# EAGLE design fresh_air_control (EAGLE 9.6.2)

## Sheet 1 of 2
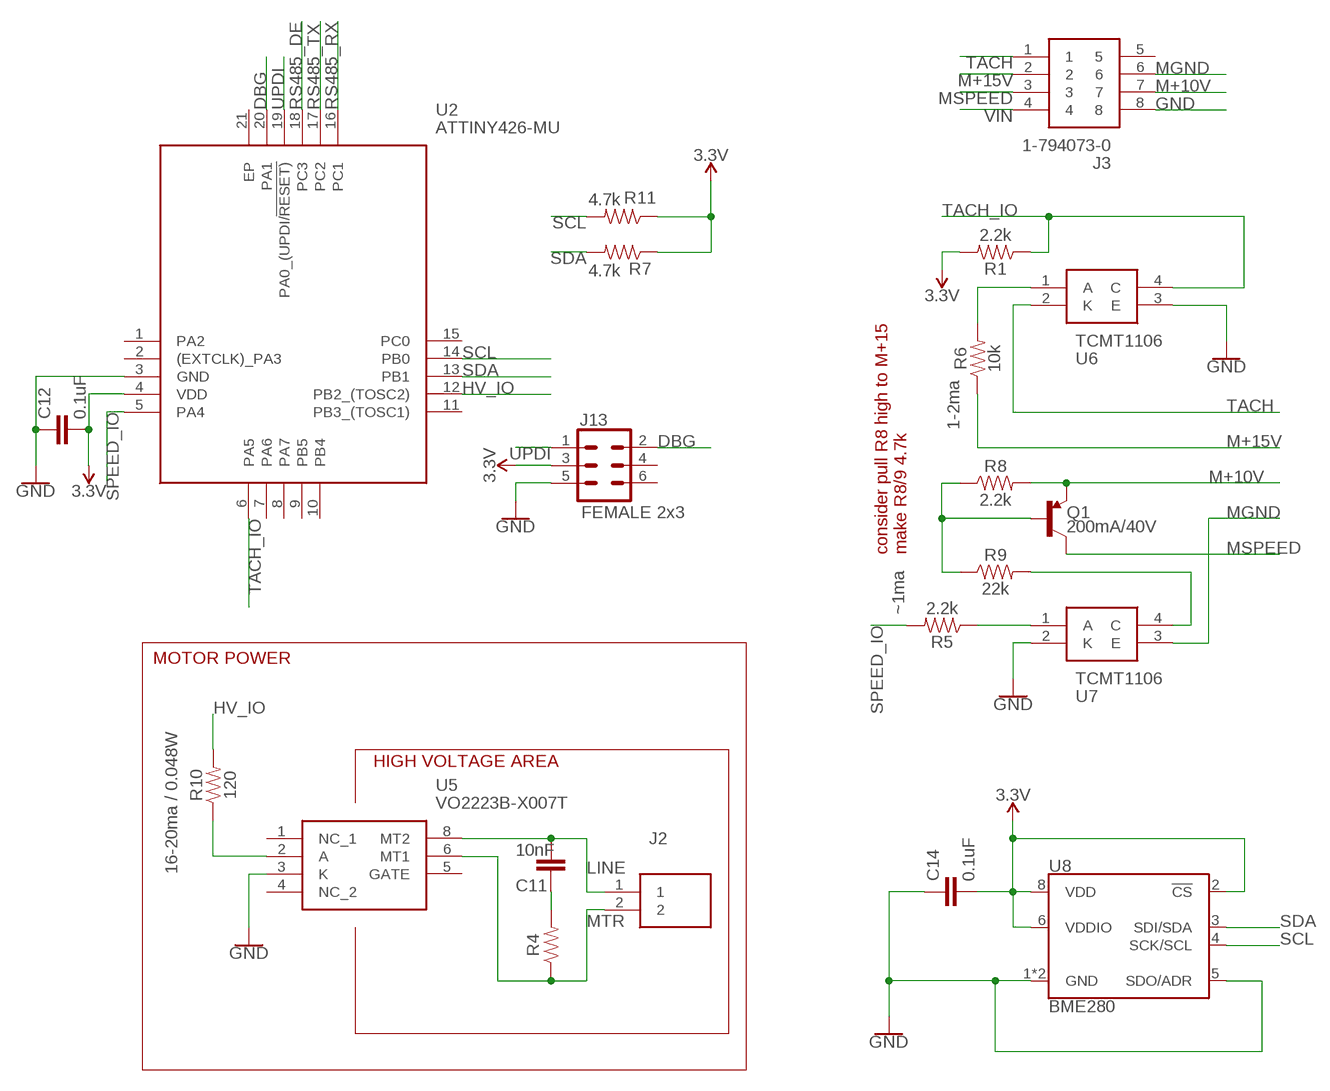
[diagram p0: schematic, sheet 1]

### Parts
C11  10nF  10NF-0805-400V-20%  [0805]
C12  0.1uF  0.1UF-0603-25V-5%  [0603]
C14  0.1uF  0.1UF-0603-25V-5%  [0603]
J2  1-770166-0  [17701660]
J3  1-794073-0  [17940730]
J13  FEMALE 2x3  CONN_03X2FEMALE  [2X3]
Q1  200mA/40V  TRANS_PNP-PMBT3906|MMBT3906L  [SOT23-3]
R1  2.2k  2.2KOHM-0603-1/10W-1%  [0603]
R4  100  100OHM-0805-1/10W-5%-400V  [0805]
R5  2.2k  2.2KOHM-0603-1/10W-1%  [0603]
R6  10k  10KOHM-0603-1/10W-1%  [0603]
R7  4.7k  4.7KOHM-0603-1/10W-1%  [0603]
R8  2.2k  2.2KOHM-0603-1/10W-1%  [0603]
R9  22k  22KOHM-0603-1/10W-1%  [0603]
R10  120  120OHM-0603-1/10W-5%  [0603]
R11  4.7k  4.7KOHM-0603-1/10W-1%  [0603]
U2  ATTINY426-MU  [QFN40P300X300X90-21N]
U5  VO2223B-X007T  [VO2223BX007T]
U6  TCMT1106  [SOIC127P700X230-4N]
U7  TCMT1106  [SOIC127P700X230-4N]
U8  BME280  [LGA-8-2.5X2.5]

### Nets
3.3V: C12.2 C14.2 J13.3 R1.2 R7.1 R11.1 U2.4(VDD) U8.2(!CS) U8.6(VDDIO) U8.8(VDD) ; also sheet 2
DBG: J13.2 U2.20(PA1)
GND: C12.1 C14.1 J3.8 J13.5 U2.3(GND) U5.3(K) U6.3(E) U7.2(K) U8.1(GND) U8.5(SDO/ADR) U8.7(GND) ; also sheet 2
HV_IO: R10.2 U2.12(PB2_(TOSC2)) ; also sheet 2
HV_SW: R10.1 U5.2(A)
LINE: C11.1 J2.1 U5.8(MT2)
M+10V: J3.7 Q1.2(E) R8.2
M+15V: J3.2 R6.1
MGND: J3.6 U7.3(E)
MSPEED: J3.3 Q1.3(C)
MTR: J2.2 R4.1 U5.6(MT1)
N$10: R6.2 U6.1(A)
N$11: C11.2 R4.2
N$13: R5.1 U7.1(A)
N$15: Q1.1(B) R8.1 R9.1
N$16: R9.2 U7.4(C)
RS485_DE: U2.18(PC3) ; also sheet 2
RS485_RX: U2.16(PC1) ; also sheet 2
RS485_TX: U2.17(PC2) ; also sheet 2
SCL: R11.2 U2.14(PB0) U8.4(SCK/SCL) ; also sheet 2
SDA: R7.2 U2.13(PB1) U8.3(SDI/SDA) ; also sheet 2
SPEED_IO: R5.2 U2.5(PA4) ; also sheet 2
TACH: J3.1 U6.2(K)
TACH_IO: R1.1 U2.6(PA5) U6.4(C) ; also sheet 2
UPDI: J13.1 U2.19(PA0_(UPDI/!RESET))
VIN: J3.4 ; also sheet 2
Unconnected: J3.5 J13.4 J13.6 U2.1(PA2) U2.2((EXTCLK)_PA3) U2.7(PA6) U2.8(PA7) U2.9(PB5) U2.10(PB4) U2.11(PB3_(TOSC1)) U2.15(PC0) U2.21(EP) U5.1(NC_1) U5.4(NC_2) U5.5(GATE)

### Notes on the sheet
- 1-2ma
- consider pull R8 high to M+15
  make R8/9 4.7k
- ~1ma
- MOTOR POWER
- HIGH VOLTAGE AREA
- 16-20ma / 0.048W

## Sheet 2 of 2
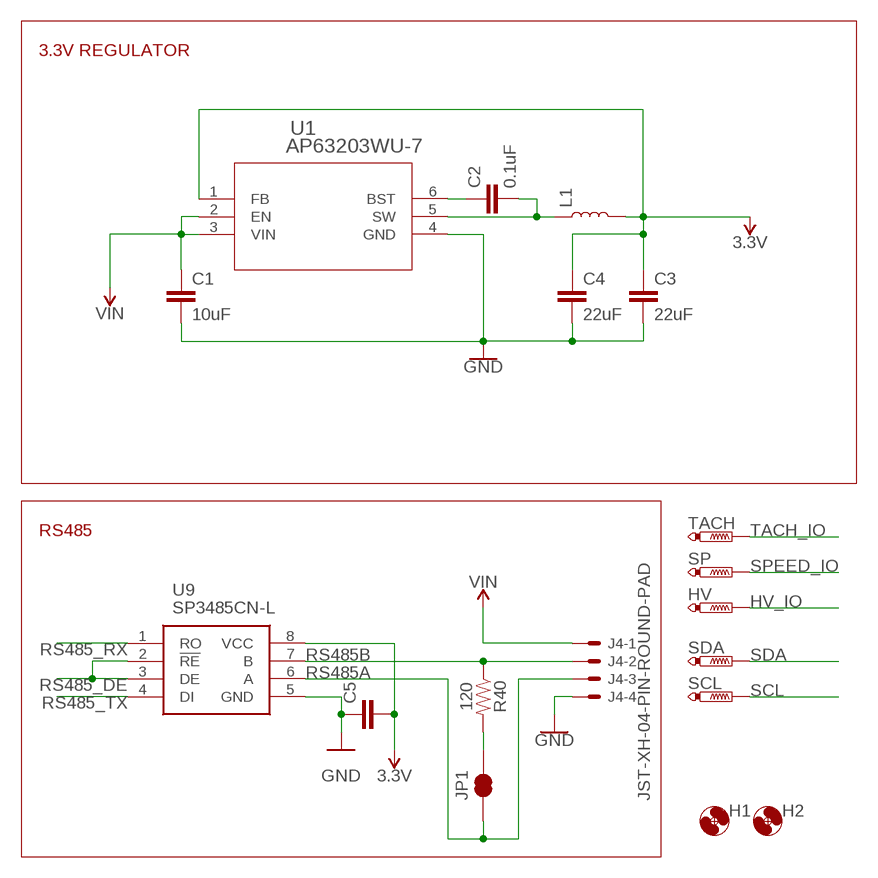
[diagram p1: schematic, sheet 2]

### Parts
C1  10uF  10UF-1206-6.3V-20%  [1206]
C2  0.1uF  0.1UF-0603-25V-5%  [0603]
C3  22uF  22UF-0805-6.3V-20%  [0805]
C4  22uF  22UF-0805-6.3V-20%  [0805]
C5  0.1uF  0.1UF-0603-25V-5%  [0603]
H1  MOUNT-HOLE3.3  [3,3]
H2  MOUNT-HOLE3.3  [3,3]
HV  PTR1B1,27  [B1,27]
J4  JST-XH-04-PIN-ROUND-PAD  [JST-XH-04-PACKAGE-ROUND-PAD]
JP1  JUMPER-SMT_2_NC_TRACE_NO-SILK  [SMT-JUMPER_2_NC_TRACE_NO-SILK]
L1  4.7μH_SHIELDED_INDUCTOR  [1008(2520)]
R40  120  120OHM-0603-1/10W-5%  [0603]
SCL  PTR1B1,27  [B1,27]
SDA  PTR1B1,27  [B1,27]
SP  PTR1B1,27  [B1,27]
TACH  PTR1B1,27  [B1,27]
U1  AP63203WU-7  [SOIC_05WU-7_DIO]
U9  SP3485CN-L  [SOIC127P600X175-8N]

### Nets
3.3V: C3.1 C4.1 C5.2 L1.2 U1.1(FB) U9.8(VCC) ; also sheet 1
GND: C1.2 C3.2 C4.2 C5.1 J4.4 U1.4(GND) U9.5(GND) ; also sheet 1
HV_IO: HV.TP ; also sheet 1
N$1: C2.2 L1.1 U1.5(SW)
N$2: C2.1 U1.6(BST)
N$3: JP1.2 R40.2
RS485_DE: U9.2(!RE) U9.3(DE) ; also sheet 1
RS485_RX: U9.1(RO) ; also sheet 1
RS485_TX: U9.4(DI) ; also sheet 1
RS485A: J4.3 JP1.1 U9.6(A)
RS485B: J4.2 R40.1 U9.7(B)
SCL: SCL.TP ; also sheet 1
SDA: SDA.TP ; also sheet 1
SPEED_IO: SP.TP ; also sheet 1
TACH_IO: TACH.TP ; also sheet 1
VIN: C1.1 J4.1 U1.2(EN) U1.3(VIN) ; also sheet 1

### Notes on the sheet
- 3.3V REGULATOR
- RS485

## Library data of the parts
C1 = SparkFun-Capacitors:10UF: 10.0µF ceramic capacitors A capacitor is a passive two-terminal electrical component used to store electrical energy temporarily in an electric field.; PROD_ID: CAP-10057
C2 C5 C12 C14 = SparkFun-Capacitors:0.1UF: 0.1µF ceramic capacitors A capacitor is a passive two-terminal electrical component used to store electrical energy temporarily in an electric field.; PROD_ID: CAP-08604
C3 C4 = SparkFun-Capacitors:22UF: 22µF ceramic capacitors A capacitor is a passive two-terminal electrical component used to store electrical energy temporarily in an electric field.; PROD_ID: CAP-08402
C11 = Capacitors:10NF
H1 H2 = holes:MOUNT-HOLE: MOUNTING HOLE with drill center marker
HV SCL SDA SP TACH = testpad:PTR1: TEST PIN
J2 = Terminals and sockets:1-770166-0: 2w Vertical pin header Tin TE Connectivity MATE-N-LOK Series, 4.14mm Pitch 2 Way Straight Heavy Duty Power Connector, Solder Termination, 9.5A Source: Datasheet <https://www.te.com/commerce/DocumentDelivery/DDEController?Action=showdoc&DocId=Customer Drawing770166MpdfEnglishENG_CD_770166_M.pdf1-770166-0>; DESCRIPTION: 2w Vertical pin header Tin TE Connectivity MATE-N-LOK Series, 4.14mm Pitch 2 Way Straight Heavy Duty Power Connector, Solder Termination, 9.5A; HEIGHT: 14.25mm; MANUFACTURER_NAME: TE Connectivity; MANUFACTURER_PART_NUMBER: 1-770166-0; MOUSER_PART_NUMBER: 571-1-770166-0; MOUSER_PRICE-STOCK: https://www.mouser.co.uk/ProductDetail/TE-Connectivity-AMP/1-770166-0?qs=m8myXnDJXpW%252BZqFFniy0cw%3D%3D
J3 = Terminals and sockets:1-794073-0: Mate-n-lok,Header,plug,8way pin contact Source: Datasheet <https://www.te.com/commerce/DocumentDelivery/DDEController?Action=showdoc&DocId=Customer Drawing794073DpdfEnglishENG_CD_794073_D.pdf1-794073-0>; DESCRIPTION: Mate-n-lok,Header,plug,8way pin contact; HEIGHT: 13.49mm; MANUFACTURER_NAME: TE Connectivity; MANUFACTURER_PART_NUMBER: 1-794073-0; MOUSER_PART_NUMBER: 571-1-794073-0; MOUSER_PRICE-STOCK: https://www.mouser.co.uk/ProductDetail/TE-Connectivity-AMP/1-794073-0/?qs=d1jXZdVA37Fr5TRKsfZNLg%3D%3D
J4 = Rembrandt Electronics - JST XH Connectors v1-0:JST-XH-04-PIN: JST XH Connector 2 Pin Wire to board connector. Pitch: 2,54 mm, (0.100") Number of pins: 4 Created by Rembrandt Electronics www.rembrandtelectronics.com
J13 = SparkFun-Connectors:CONN_03X2: Multi connection point. Often used as Generic Header-pin footprint for 0.1 inch spaced/style header connections You can populate with any combo of single row headers, but if you'd like an exact match, check these: Header - 2x3 (Male, 0.1") <https://www.sparkfun.com/products/12807> (PRT-12807) Header - 2x3 (Female, 0.1") <https://www.sparkfun.com/products/13010> (PRT-13010) 2x3 Pin Shrouded Header <https://www.sparkfun.com/products/10877> (PRT-10877) On any of the 0.1 inch spaced packages, you can populate with these: Break Away Headers - Straight <https://www.sparkfun.com/products/116> (PRT-00116) Break Away Male Headers - Right Angle <https://www.sparkfun.com/products/553> (PRT-00553) Female Headers <https://www.sparkfun.com/products/115> (PRT-00115) Break Away Headers - Machine Pin <https://www.sparkfun.com/products/117> (PRT-00117) Break Away Female Headers - Swiss Machine Pin <https://www.sparkfun.com/products/743> (PRT-00743) Special note: the shrouded connector mates well with our 3x2 ribbon cables: Ribbon Crimp Connector - 6-pin (2x3, Female) <https://www.sparkfun.com/products/10651> (PRT-10651) Ribbon Cable - 6 wire (15ft) <https://www.sparkfun.com/products/10646> (PRT-10646); PROD_ID: CONN-11566
JP1 = SparkFun-Jumpers:JUMPER-SMT_2_NC_TRACE: Normally closed trace jumper This jumper has a trace between two pads so it's normally closed (NC). Use a razor knife to open the connection. For best results follow the IPC guidelines for cutting traces: Cutout at least 0.063 mm (0.005 in). Remove all loose material to clean up the cut area. Seal the cut with an approved epoxy. Reapply solder to reclose the connection.
L1 = SparkFun-Coils:4.7μH_SHIELDED_INDUCTOR: 4.7uH Inductor 4.7uH 1.4A 50mOhm 1008(2520) Package Shielded; PROD_ID: NDUC-14880
Q1 = SparkFun-DiscreteSemi:TRANS_PNP: PNP transistor Current controlled devices typically used to amplify current or used as a switch. SparkFun Products: SparkFun Serial Enabled 16x2 LCD - Red on Black <https://www.sparkfun.com/products/9068> SparkFun Logomatic <https://www.sparkfun.com/products/12772>; PROD_ID: TRANS-08052
R1 R5 R8 = SparkFun-Resistors:2.2KOHM: 2.2kΩ resistor A resistor is a passive two-terminal electrical component that implements electrical resistance as a circuit element. Resistors act to reduce current flow, and, at the same time, act to lower voltage levels within circuits. - Wikipedia; PROD_ID: RES-08272
R4 = Resistors:100OHM
R6 = SparkFun-Resistors:10KOHM: 10kΩ resistor A resistor is a passive two-terminal electrical component that implements electrical resistance as a circuit element. Resistors act to reduce current flow, and, at the same time, act to lower voltage levels within circuits. - Wikipedia; PROD_ID: RES-00824
R7 R11 = SparkFun-Resistors:4.7KOHM: 4.7kΩ resistor A resistor is a passive two-terminal electrical component that implements electrical resistance as a circuit element. Resistors act to reduce current flow, and, at the same time, act to lower voltage levels within circuits. - Wikipedia; PROD_ID: RES-07857
R9 = SparkFun-Resistors:22KOHM: 22kΩ resistor A resistor is a passive two-terminal electrical component that implements electrical resistance as a circuit element. Resistors act to reduce current flow, and, at the same time, act to lower voltage levels within circuits. - Wikipedia; PROD_ID: RES-07853
R10 R40 = Resistors:120OHM
U1 = Diodes buck converter:AP63203WU-7; COPYRIGHT: Copyright (C) 2023 Ultra Librarian. All rights reserved.; MANUFACTURER_PART_NUMBER: AP63203WU-7; MFR_NAME: Diodes Inc
U2 = ATTINY426-MU:ATTINY426-MU: 8-bit Microcontrollers - MCU 20MHz, 4KB,VQFN20, Ind 85C, Green Source: Datasheet <https://www.microchip.com/content/dam/mchp/documents/MCU08/ProductDocuments/DataSheets/ATtiny424-426-427-824-826-827-DataSheet-DS40002311A.pdf>; DESCRIPTION: 8-bit Microcontrollers - MCU 20MHz, 4KB,VQFN20, Ind 85C, Green; HEIGHT: 0.9mm; MANUFACTURER_NAME: Microchip; MANUFACTURER_PART_NUMBER: ATTINY426-MU; MOUSER_PART_NUMBER: 579-ATTINY426-MU; MOUSER_PRICE-STOCK: https://www.mouser.co.uk/ProductDetail/Microchip-Technology/ATTINY426-MU?qs=pUKx8fyJudAatJqFKBSQfg%3D%3D
U5 = VO2223B-X007T:VO2223B-X007T: Triac & SCR Output Optocouplers 1A, 600V PhotoTRIAC SMD-8, UL, cUL Source: Datasheet <https://www.vishay.com/docs/83312/vo2223b.pdf>; DESCRIPTION: Triac & SCR Output Optocouplers 1A, 600V PhotoTRIAC SMD-8, UL, cUL; HEIGHT: 4.6mm; MANUFACTURER_NAME: Vishay; MANUFACTURER_PART_NUMBER: VO2223B-X007T; MOUSER_PART_NUMBER: 78-VO2223B-X007T; MOUSER_PRICE-STOCK: https://www.mouser.co.uk/ProductDetail/Vishay-Semiconductors/VO2223B-X007T?qs=r5DSvlrkXmLdAybzHjTr7g%3D%3D
U6 U7 = TCMT1106:TCMT1106: Optocoupler Transistor O/P 1-CH Source: Datasheet <https://www.vishay.com/docs/83510/tcmt1100.pdf>; DESCRIPTION: Optocoupler Transistor O/P 1-CH; HEIGHT: 2.3mm; MANUFACTURER_NAME: Vishay; MANUFACTURER_PART_NUMBER: TCMT1106; MOUSER_PART_NUMBER: 782-TCMT1106; MOUSER_PRICE-STOCK: https://www.mouser.co.uk/ProductDetail/Vishay-Semiconductors/TCMT1106?qs=iFB%2FIts7N%252BA3ecLP71cKjQ%3D%3D
U8 = SparkFun-Sensors:BME280: Bosch BME280 – Combined Humidity and Pressure Sensor The BME280 is as combined digital humidity, pressure and temperature sensor based on proven sensing principles. The sensor module is housed in an extremely compact metal-lid LGA package with a footprint of only 2.5×2.5mm² with a height of 0.93mm. Its small dimensions and its low power consumption allow the implementation in battery driven devices such as handsets, GPS modules or watches. Datasheet <https://cdn.sparkfun.com/assets/learn_tutorials/4/1/9/BST-BME280_DS001-10.pdf> SparkFun Products SparkFun Atmospheric Sensor Breakout - BME280 <https://www.sparkfun.com/products/13676> (SEN-13676); PROD_ID: IC-13090
U9 = MaxLinear RS485 SP3485CN-L:SP3485CN-L: Transceiver RS-485 3.3V 10Mbps SOIC8 EXAR SP3485CN-L, Line Transceiver, RS-422, RS-485, 3.3 V, 8-Pin SOIC Source: Datasheet <https://componentsearchengine.com/Datasheets/1/SP3485CN-L.pdf>; DESCRIPTION: Transceiver RS-485 3.3V 10Mbps SOIC8 EXAR SP3485CN-L, Line Transceiver, RS-422, RS-485, 3.3 V, 8-Pin SOIC; HEIGHT: 1.75mm; MANUFACTURER_NAME: EXAR; MANUFACTURER_PART_NUMBER: SP3485CN-L; MOUSER_PART_NUMBER: 701-SP3485CN-L; MOUSER_PRICE-STOCK: https://www.mouser.com/Search/Refine.aspx?Keyword=701-SP3485CN-L

## Board
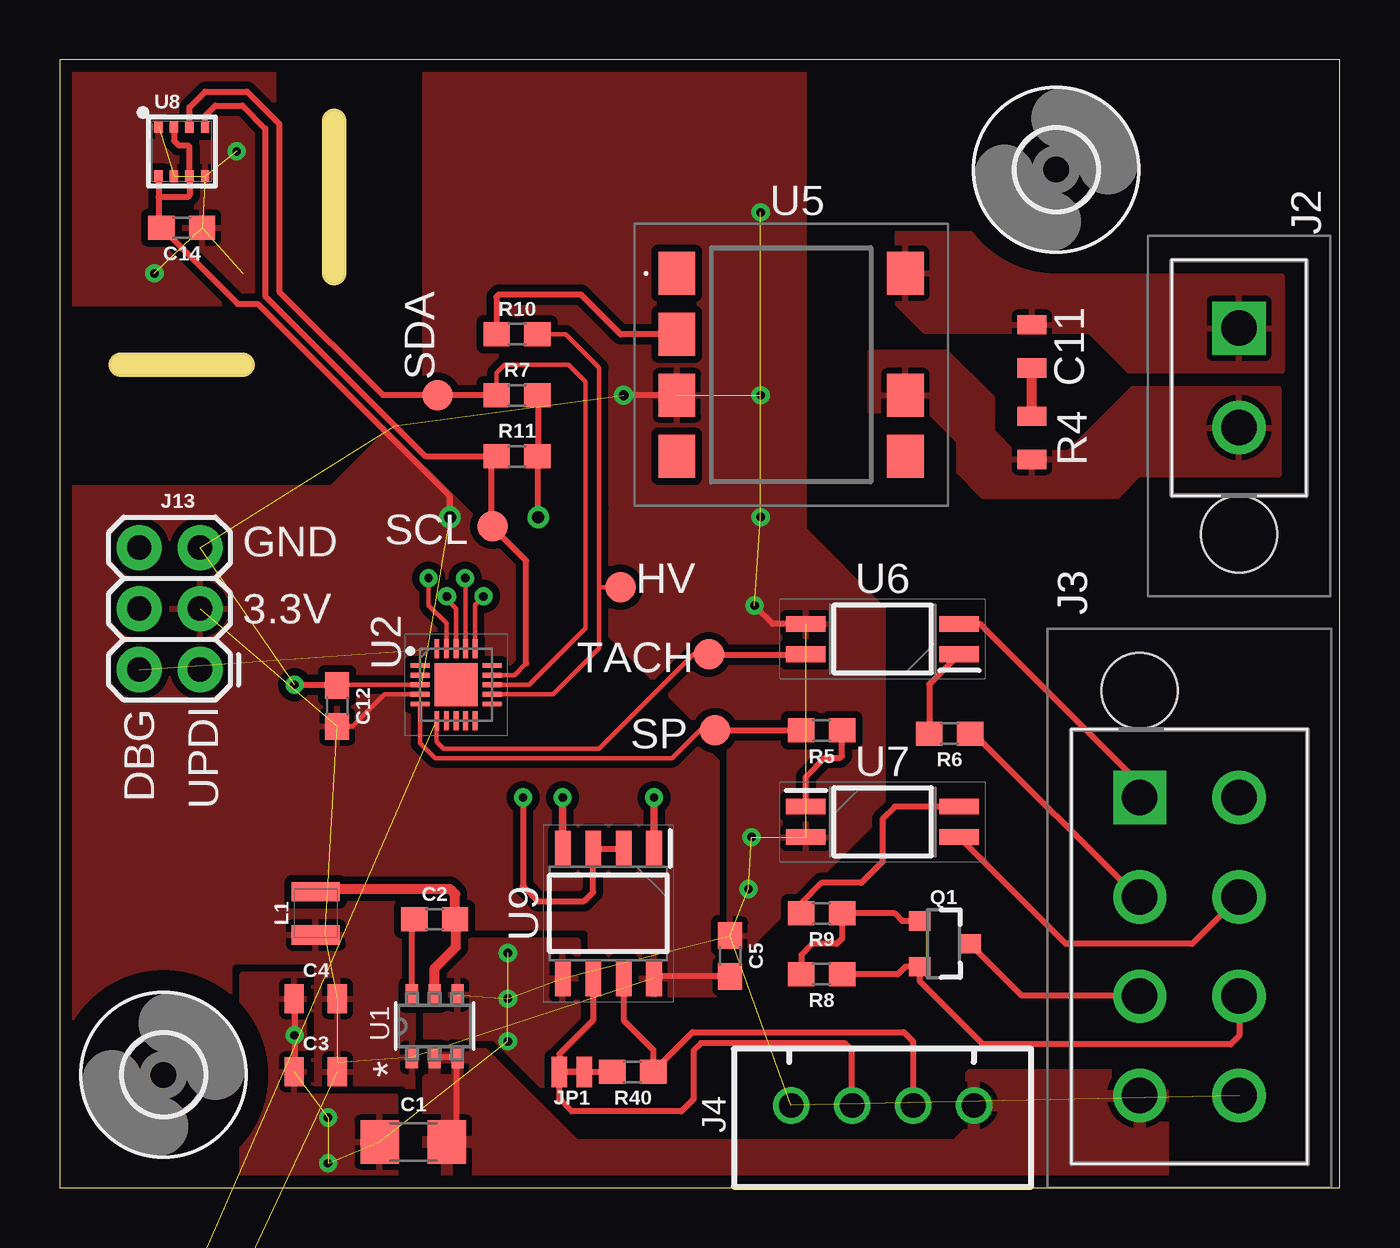
[diagram p2: board, top side]
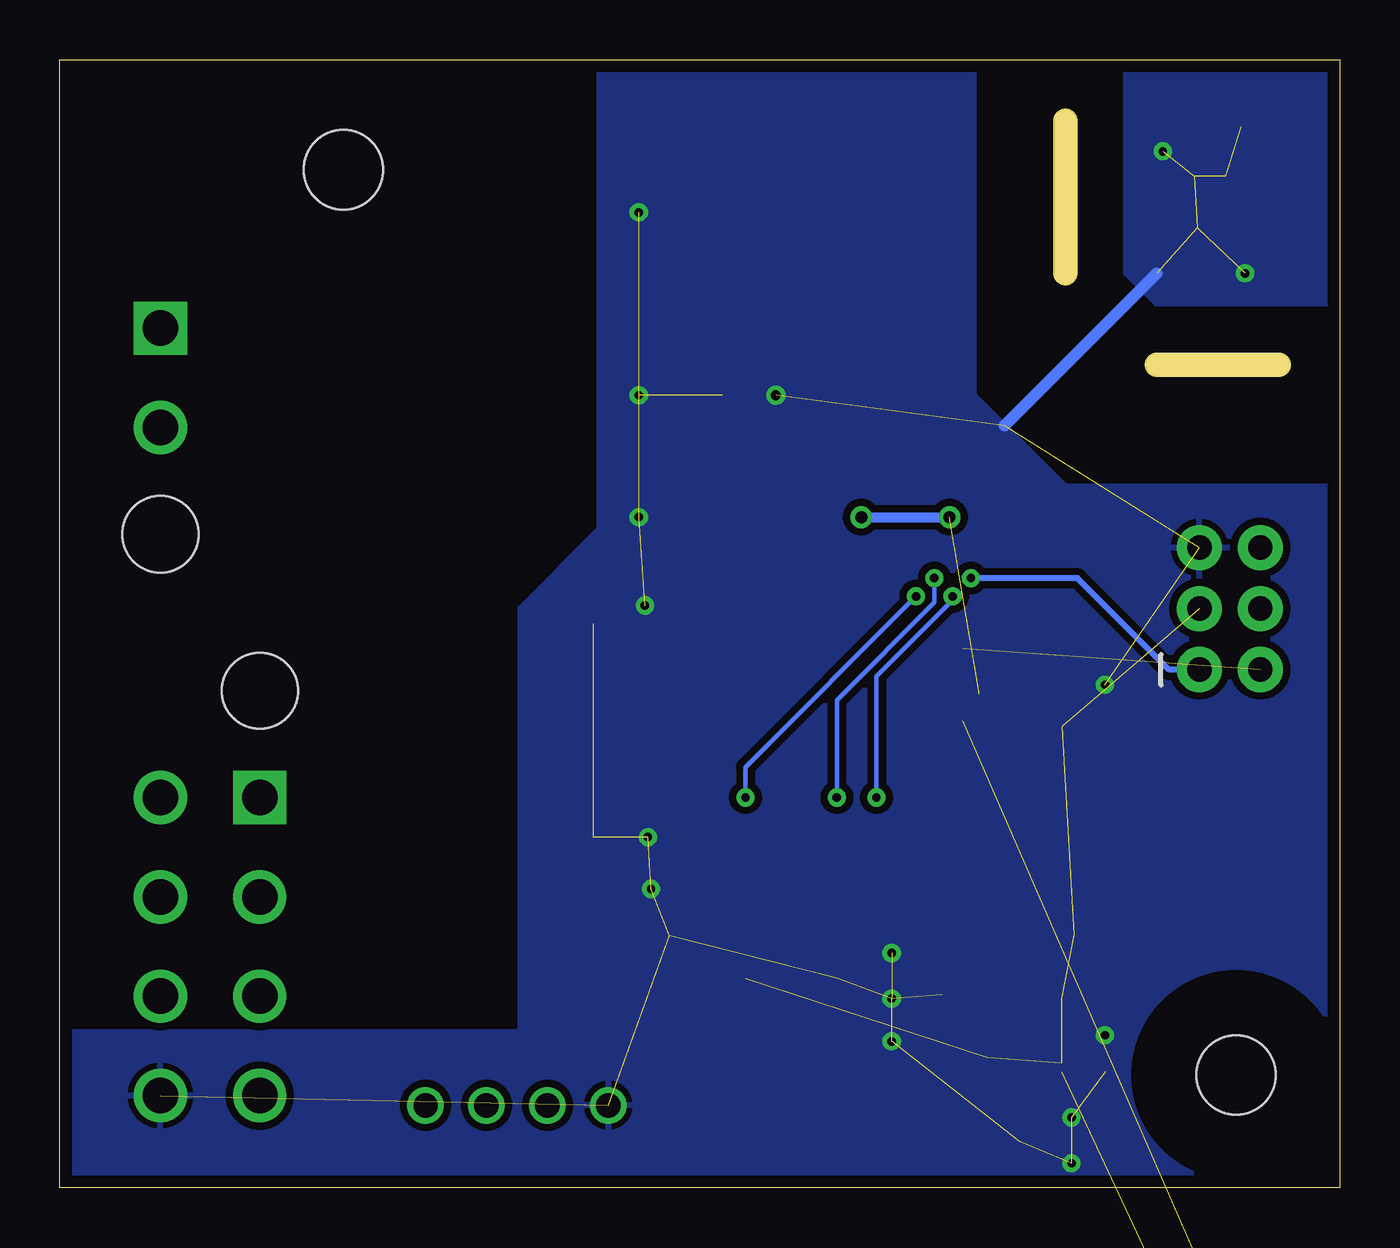
[diagram p3: board, bottom side, seen from below]

Size 53.34 x 46.99 mm. Coordinates in mm from the lower left corner, seen from the top.
Outline: 2.54,34.29 7.62,34.29
Outline: 11.43,44.45 11.43,38.1
Outline: 0,0 53.34,0 53.34,46.99 0,46.99 0,0
Copper layers (1*16): Top 0.035mm / dielectric 1.6mm / Bottom 0.035mm
Design rules "Elecrow_2-layer_PCB_eagle_rule_conservative *": minimum track width 7mil, minimum drill 12mil, track to track 8mil, track to pad 6mil, pad to pad 6mil, via to via 8mil, smd to smd 0mil, copper to edge 20mil, drill to drill 10mil, minimum pad ring 8mil, minimum via ring 8mil, stop-mask expansion 0mil, vias tented up to drill 100mil, thermal gap 10mil
Milling: 2 lines

### Footprints (pad centres in the part's own frame; a part is rotated, then mirrored left to right if it is on the bottom)
1206 = smd 1.6 x 1.8: 1 -1.4,0; 2 1.4,0
0603 = smd 1.1 x 1: 1 -0.85,0; 2 0.85,0
0805 = smd 0.8 x 1.2: 1 -0.9,0; 2 0.9,0
3,3 = hole 3.3: 0,0
B1,27 = smd 1.27 x 1.27: TP 0,0
17701660 = drill 1.48 pad 2.22 square: 1 0,0 | drill 1.48 pad 2.22: 2 4.14,0 | hole 3.18: 8.59,0
17940730 = drill 1.48 pad 2.22 square: 1 0,0.07 | drill 1.48 pad 2.22: 2 -4.14,0.07; 3 -8.28,0.07; 4 -12.42,0.07; 5 0,-4.07; 6 -4.14,-4.07; 7 -8.28,-4.07; 8 -12.42,-4.07 | hole 3.17: 4.45,0.07
JST-XH-04-PACKAGE-ROUND-PAD = drill 1.016: 1 -3.81,0; 2 -1.27,0; 3 1.27,0; 4 3.81,0
2X3 = drill 1.016 pad 1.88: 1 0,0; 2 0,2.54; 3 2.54,0; 4 2.54,2.54; 5 5.08,0; 6 5.08,2.54
SMT-JUMPER_2_NC_TRACE_NO-SILK = smd 0.66 x 1.27: 1 -0.521,0; 2 0.521,0
1008(2520) = smd 0.8 x 2: 1 -0.9,0; 2 0.9,0
SOT23-3 = smd 0.8 x 0.9: 1 -0.95,-1; 2 0.95,-1; 3 0,1.1
SOIC_05WU-7_DIO = smd 0.902 x 0.508: 1 -1.302,0.95; 2 -1.302,0; 3 -1.302,-0.95; 4 1.302,-0.95; 5 1.302,0; 6 1.302,0.95
QFN40P300X300X90-21N = smd 0.8 x 0.2: 1 -1.5,0.8; 2 -1.5,0.4; 3 -1.5,0; 4 -1.5,-0.4; 5 -1.5,-0.8; 11 1.5,-0.8; 12 1.5,-0.4; 13 1.5,0; 14 1.5,0.4; 15 1.5,0.8 | smd 0.2 x 0.8: 6 -0.8,-1.5; 7 -0.4,-1.5; 8 0,-1.5; 9 0.4,-1.5; 10 0.8,-1.5; 16 0.8,1.5; 17 0.4,1.5; 18 0,1.5; 19 -0.4,1.5; 20 -0.8,1.5 | smd 1.8 x 1.8: 21 0,0
VO2223BX007T = smd 1.525 x 1.78: 1 -4.762,3.81; 2 -4.762,1.27; 3 -4.762,-1.27; 4 -4.762,-3.81; 5 4.763,-3.81; 6 4.763,-1.27; 8 4.763,3.81
SOIC127P700X230-4N = smd 1.65 x 0.65: 1 -3.2,0.635; 2 -3.2,-0.635; 3 3.2,-0.635; 4 3.2,0.635
LGA-8-2.5X2.5 = smd 0.35 x 0.5: 1 -0.975,1.025; 2 -0.325,1.025; 3 0.325,1.025; 4 0.975,1.025; 5 0.975,-1.025; 6 0.325,-1.025; 7 -0.325,-1.025; 8 -0.975,-1.025
SOIC127P600X175-8N = smd 1.5 x 0.65: 1 -2.7,1.905; 2 -2.7,0.635; 3 -2.7,-0.635; 4 -2.7,-1.905; 5 2.7,-1.905; 6 2.7,-0.635; 7 2.7,0.635; 8 2.7,1.905

### Placement (x,y rotation side)
C1  14.73,1.91 180 top
C2  15.62,11.18 0 top
C3  10.67,4.83 180 top
C4  10.67,7.87 180 top
C5  27.94,9.65 270 top
C11  40.51,35.05 270 top
C12  11.56,20.07 270 top
C14  5.08,40.01 180 top
H1  4.32,4.7 0 top
H2  41.53,42.42 0 top
HV  23.37,25.02 0 top
J2  49.15,35.81 270 top
J3  45.09,16.26 90 top
J4  34.29,3.43 180 top
J13  5.84,21.59 90 top
JP1  21.34,4.83 0 top
L1  10.67,11.43 270 top
Q1  36.83,10.16 270 top
R1  2.54,-12.7 0 top  (outside the outline)
R4  40.51,31.24 90 top
R5  31.75,19.05 180 top
R6  37.08,18.92 180 top
R7  19.05,33.02 180 top
R8  31.75,8.89 0 top
R9  31.75,11.43 180 top
R10  19.05,35.56 0 top
R11  19.05,30.48 180 top
R40  23.88,4.83 180 top
SCL  18.03,27.56 0 top
SDA  15.75,33.02 0 top
SP  27.3,19.05 0 top
TACH  27.05,22.23 0 top
U1  15.62,6.73 90 top
U2  16.51,20.95 0 top
U5  30.48,34.29 0 top
U6  34.29,22.86 180 top
U7  34.29,15.24 0 top
U8  5.08,43.18 0 top
U9  22.86,11.43 270 top

### Tracks (layer width: path | path; a pad name or v marks a point on that pad's centre or on a via)
3.3V  (via drill 0.5)  (8 unrouted)
  Top 0.178: U2.4 13.53,20.55 12.19,19.22 C12.2
  Top 0.254: U8.8 4.11,41.27 | 4.11,41.27 4.11,40.13 C14.2 7.41,36.83 8.23,36.83 16.26,28.81 v16.26,27.94 | 4.11,41.27 5.33,41.27 5.41,41.35 U8.6 5.41,43.36 5.33,43.43 4.95,43.43 4.75,43.63 U8.2 | v19.94,27.94 19.94,30.44 | 19.94,30.44 R11.1 | R7.1 19.94,32.98 19.94,30.44 | C3.1 11.57,5.21 | 11.06,10.53 L1.2 | C5.2 24.84,8.8 U9.8
  Bottom 0.406: v19.94,27.94 v16.26,27.94
  pour Top (isolate 0.305, rank 3): 0,29.21 11.3,29.21 13.65,31.56 27.43,17.78 27.43,8 14.86,8 14.86,4.19 0,4.19
DBG  (1 unrouted)
GND  (via drill 0.35, 0.4)  (28 unrouted)
  Top 0.178: 11.52,20.95 C12.1 11.6,20.95 U2.3
  Top 0.254: U6.3 29.72,23.5 v28.96,24.26 | U5.3 v23.5,33.02 | C4.2 v9.78,6.35 C3.2 | v9.78,20.95 11.52,20.95
  Bottom 0.508: 7.62,38.1 13.97,31.75
  other vias: 3.94,38.1 7.37,43.18 28.83,14.61 18.67,7.87 29.21,40.64 29.21,27.94 29.21,33.02 11.18,1.02 11.18,2.92 18.67,9.78 18.67,6.1 28.7,12.45
  pour Top (isolate 0.305): 0,46.99 8.89,46.99 8.89,37.97 7.75,36.83 0,36.83
  pour Bottom (isolate 0.305): 0,46.99 0,36.83 7.62,36.83 8.89,38.1 8.89,46.99
  pour Bottom (isolate 0.305): 0,29.21 11.43,29.21 15.24,33.02 15.24,46.99 30.86,46.99 30.86,27.43 34.16,24.13 34.16,6.48 53.34,6.48 53.34,0 0,0
  pour Top (isolate 0.305): 8.89,8.89 10.16,8.89 10.16,3.81 13.97,3.81 13.97,0 7.62,0 7.62,8.89
  pour Top (isolate 0.305, rank 2): 15.24,2.54 21.59,2.54 21.59,10.29 15.24,10.29
  pour Top (isolate 0.305, rank 4): 15.24,46.99 30.99,46.99 30.99,27.43 34.29,24.13 34.29,15.62 28.7,10.03 27.94,10.03 27.94,18.03 14.1,31.88 15.24,33.02
HV_IO
  Top 0.178: R10.2 21.08,35.56 22.48,34.16 22.48,28.32 22.48,25.02 | U2.12 20.55,20.55 22.48,22.48 22.48,25.02 | HV.TP 22.48,25.02
HV_SW
  Top 0.254: R10.1 18.2,37.12 18.29,37.21 19.56,37.21 21.72,37.21 23.37,35.56 U5.2
LINE
  pour Top (isolate 0.254): 34.92,39.75 41.53,39.75 41.53,37.97 50.93,37.97 50.93,34.04 44.58,34.04 42.93,35.69 36.07,35.69 34.92,36.83
M+10V
  Top 0.254: R8.2 34.92,8.89 35.24,9.21 Q1.2 35.83,8.62 38.48,5.97 48.8,5.97 49.16,6.33 J3.7
M+15V
  Top 0.254: R6.1 38.1,18.92 44.91,12.12 J3.2
MGND
  Top 0.254: U7.3 41.94,10.16 47.2,10.16 J3.6
MSPEED
  Top 0.254: J3.3 44.99,8 40.09,8 Q1.3
MTR
  pour Top: 33.78,32.38 36.2,32.38 37.47,31.11 37.47,29.84 38.48,28.83 44.07,28.83 44.96,29.72 50.8,29.72 50.8,33.27 44.7,33.27 42.04,30.61 39.75,30.61 38.86,31.5 38.86,32.89 36.96,34.8 33.78,34.8
N$1
  Top 0.254: 16.51,11.14 C2.2 | L1.1 10.78,12.45
  Top 0.406: U1.5 15.62,9.14 16.51,10.03 16.51,11.14 | C2.2 16.47,12.23 16.26,12.45 10.78,12.45
N$2
  Top 0.254: U1.6 14.67,11.08 C2.1
N$3
  Top 0.254: JP1.2 R40.2
N$10
  Top 0.254: U6.1 36.23,20.97 R6.2
N$11
  Top 0.406: R4.2 C11.2
N$13
  Top 0.254: U7.1 31.09,17.12 31.88,17.91 32.51,17.91 32.6,18 R5.1
N$15
  Top 0.254: R8.1 30.9,9.69 31.37,10.16 32.38,10.16 32.6,10.38 R9.1 34.8,11.43 35.12,11.11 Q1.1
N$16
  Top 0.254: R9.2 30.9,11.85 31.75,12.7 33.4,12.7 34.29,13.59 34.29,15.37 34.8,15.88 U7.4
RS485_DE  (via drill 0.35)
  Top 0.178: U2.18 16.51,24.13 16.13,24.51 v16.13,24.64
  Top 0.254: U9.2 U9.3 22.23,12.32 21.84,11.94 19.94,11.94 19.3,12.57 v19.3,16.26
  Bottom 0.178: v16.13,24.64 16.13,24.48 19.3,21.3 v19.3,16.26
RS485_RX  (via drill 0.35)
  Top 0.178: U2.16 17.31,24.3 v17.65,24.64
  Top 0.305: v24.77,16.26 U9.1
  Bottom 0.178: v17.65,24.64 24.77,17.53 v24.77,16.26
RS485_TX  (via drill 0.35)
  Top 0.178: U2.17 16.91,25.38 v16.89,25.4
  Top 0.305: v20.95,16.26 U9.4
  Bottom 0.178: v20.95,16.26 20.95,20.32 16.89,24.38 v16.89,25.4
RS485A
  Top 0.254: U9.6 22.23,6.99 20.82,5.58 JP1.1 20.82,3.7 21.34,3.17 25.91,3.17 26.42,3.68 26.42,5.71 26.72,6.02 32.72,6.02 33.02,5.71 J4.3
RS485B
  Top 0.254: J4.2 35.56,6.1 35.18,6.48 26.38,6.48 R40.1 24.73,5.75 23.5,6.99 U9.7
SCL
  Top 0.178: U2.14 18.94,21.36 19.43,21.84
  Top 0.254: U8.4 6.05,44.66 6.48,45.09 7.61,45.09 8.56,44.13 8.56,37.15 15.23,30.48 R11.2 17.99,30.27 17.99,27.56 | SCL.TP 17.99,27.56 | 19.43,21.84 19.43,26.12 17.99,27.56
SDA
  Top 0.178: R7.2 18.2,33.95 18.54,34.29 21.21,34.29 21.92,33.58 21.92,23.32 19.56,20.95 U2.13
  Top 0.254: R7.2 SDA.TP 13.46,33.02 9.14,37.34 9.14,44.32 7.8,45.67 6.04,45.67 5.41,45.03 U8.3
SPEED_IO
  Top 0.178: U2.5 15.01,18.52 15.63,17.9 25.52,17.9 26.67,19.05 SP.TP
  Top 0.254: SP.TP 30.39,19.05 | 30.39,19.05 | 30.39,19.05 R5.2
TACH
  Top 0.254: U6.2 38.35,23.5 45.02,16.83 J3.1
TACH_IO  (1 unrouted)
  Top 0.178: U2.6 15.71,18.58 16,18.29 22.48,18.29 26.42,22.23 TACH.TP
  Top 0.254: U6.4 31.09,22.2 27.08,22.2 TACH.TP
UPDI  (via drill 0.35)
  Top 0.178: U2.19 16.11,23.51 15.37,24.26 v15.37,25.4
  Bottom 0.254: J13.1 7.11,21.59 10.92,25.4 v15.37,25.4
VIN
  Top 0.254: U1.2 U1.3 16.51,5.37 16.51,2.28 C1.1
  pour Top (isolate 0.381): 15.37,5.59 17.65,5.59 21.46,1.78 37.34,1.78 37.97,2.41 37.97,4.7 45.97,4.7 45.97,-0.02 15.37,-0.02

### Text on the board
tNames: GND | 3.3V | DBG | UPDI